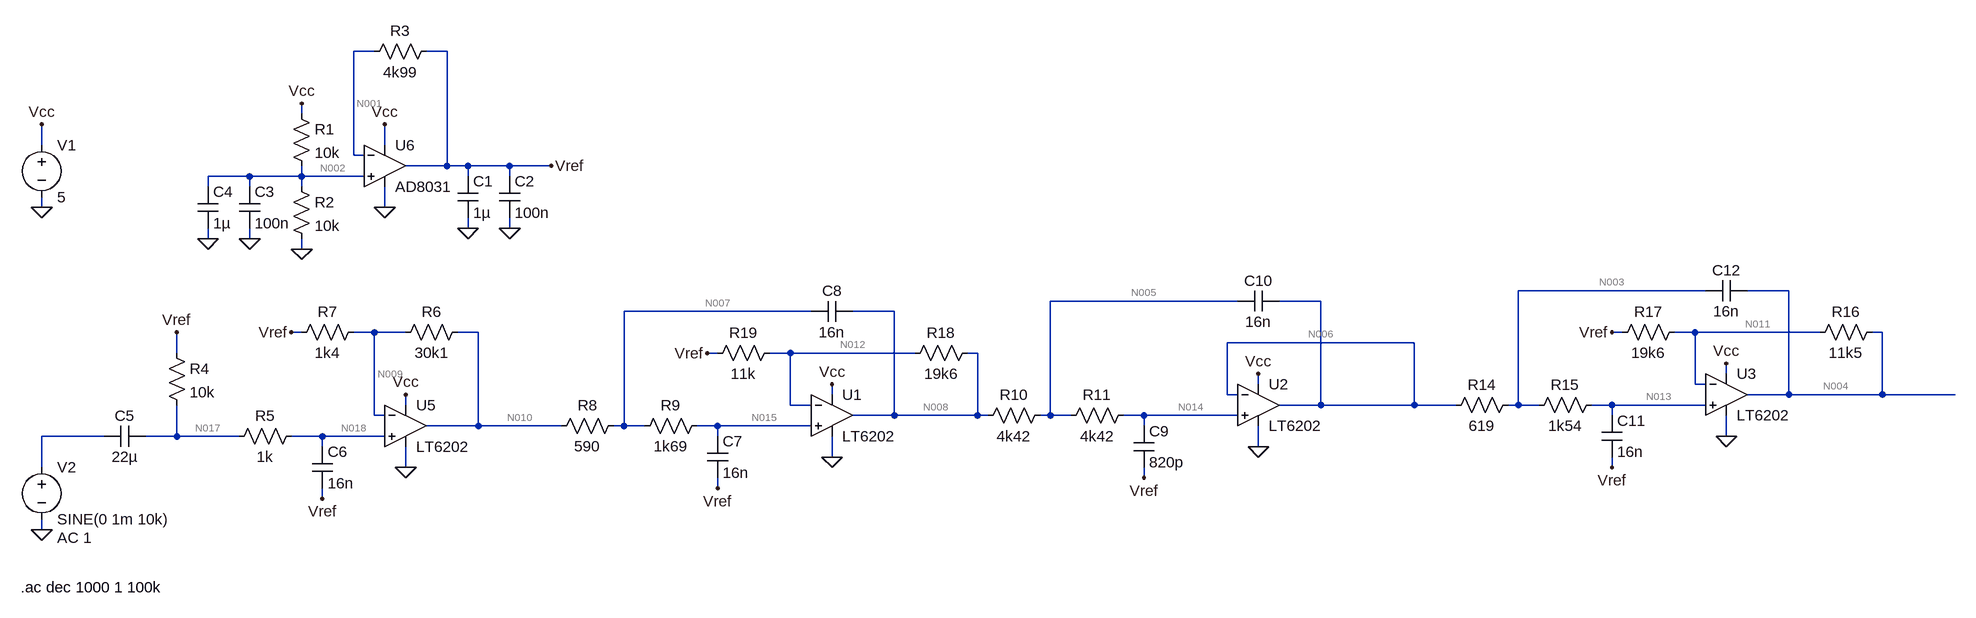
[diagram p0: schematic Input_Stage_10kHz.asc]
Input_Stage_10kHz.asc, the LTspice schematic file:
Version 4
SHEET 1 3012 680
WIRE 272 -400 240 -400
WIRE 384 -400 352 -400
WIRE 160 -304 160 -320
WIRE -240 -256 -240 -288
WIRE 288 -256 288 -288
WIRE 240 -240 240 -400
WIRE 256 -240 240 -240
WIRE 384 -224 384 -400
WIRE 384 -224 320 -224
WIRE 416 -224 384 -224
WIRE 480 -224 416 -224
WIRE 544 -224 480 -224
WIRE 80 -208 16 -208
WIRE 160 -208 160 -224
WIRE 160 -208 80 -208
WIRE 256 -208 160 -208
WIRE 416 -208 416 -224
WIRE 480 -208 480 -224
WIRE 16 -192 16 -208
WIRE 80 -192 80 -208
WIRE 160 -192 160 -208
WIRE -240 -160 -240 -176
WIRE 288 -160 288 -192
WIRE 416 -128 416 -144
WIRE 480 -128 480 -144
WIRE 16 -112 16 -128
WIRE 80 -112 80 -128
WIRE 160 -96 160 -112
WIRE 2320 -32 2032 -32
WIRE 2448 -32 2384 -32
WIRE 1600 -16 1312 -16
WIRE 1728 -16 1664 -16
WIRE 944 0 656 0
WIRE 1072 0 1008 0
WIRE 160 32 144 32
WIRE 272 32 240 32
WIRE 320 32 272 32
WIRE 432 32 400 32
WIRE 2192 32 2176 32
WIRE 2304 32 2272 32
WIRE 2496 32 2304 32
WIRE 2592 32 2576 32
WIRE 1872 48 1584 48
WIRE -32 64 -32 32
WIRE 800 64 784 64
WIRE 912 64 880 64
WIRE 1104 64 912 64
WIRE 1200 64 1184 64
WIRE 2352 96 2352 80
WIRE 1632 112 1632 96
WIRE 2304 112 2304 32
WIRE 2320 112 2304 112
WIRE 976 128 976 112
WIRE 1584 128 1584 48
WIRE 1600 128 1584 128
WIRE 2448 128 2448 -32
WIRE 2448 128 2384 128
WIRE 2592 128 2592 32
WIRE 2592 128 2448 128
WIRE 2704 128 2592 128
WIRE 320 144 320 128
WIRE 912 144 912 64
WIRE 944 144 912 144
WIRE 1728 144 1728 -16
WIRE 1728 144 1664 144
WIRE 1872 144 1872 48
WIRE 1872 144 1728 144
WIRE 1936 144 1872 144
WIRE 2032 144 2032 -32
WIRE 2032 144 2016 144
WIRE 2064 144 2032 144
WIRE 2176 144 2144 144
WIRE 2320 144 2176 144
WIRE 272 160 272 32
WIRE 288 160 272 160
WIRE 1072 160 1072 0
WIRE 1072 160 1008 160
WIRE 1200 160 1200 64
WIRE 1200 160 1072 160
WIRE 1216 160 1200 160
WIRE 1312 160 1312 -16
WIRE 1312 160 1296 160
WIRE 1344 160 1312 160
WIRE 1456 160 1424 160
WIRE 1600 160 1456 160
WIRE 2176 160 2176 144
WIRE 432 176 432 32
WIRE 432 176 352 176
WIRE 560 176 432 176
WIRE 656 176 656 0
WIRE 656 176 640 176
WIRE 688 176 656 176
WIRE 800 176 768 176
WIRE 944 176 800 176
WIRE 1456 176 1456 160
WIRE -144 192 -240 192
WIRE -32 192 -32 144
WIRE -32 192 -80 192
WIRE 64 192 -32 192
WIRE 192 192 144 192
WIRE 288 192 192 192
WIRE 800 192 800 176
WIRE 2352 192 2352 160
WIRE 192 208 192 192
WIRE 1632 208 1632 176
WIRE 976 224 976 192
WIRE -240 240 -240 192
WIRE 320 240 320 208
WIRE 2176 240 2176 224
WIRE 1456 256 1456 240
WIRE 800 272 800 256
WIRE 192 288 192 272
WIRE -240 336 -240 320
FLAG -240 -160 0
FLAG -240 336 0
FLAG -240 -288 Vcc
FLAG 288 -160 0
FLAG 288 -288 Vcc
FLAG 160 -320 Vcc
FLAG 160 -96 0
FLAG 416 -128 0
FLAG 480 -128 0
FLAG 544 -224 Vref
FLAG 16 -112 0
FLAG 80 -112 0
FLAG -32 32 Vref
FLAG 192 288 Vref
FLAG 320 240 0
FLAG 320 128 Vcc
FLAG 800 272 Vref
FLAG 976 224 0
FLAG 976 112 Vcc
FLAG 144 32 Vref
FLAG 1456 256 Vref
FLAG 1632 208 0
FLAG 1632 96 Vcc
FLAG 2176 240 Vref
FLAG 2352 192 0
FLAG 2352 80 Vcc
FLAG 2176 32 Vref
FLAG 784 64 Vref
SYMBOL voltage -240 -272 R0
WINDOW 123 0 0 Left 0
WINDOW 39 0 0 Left 0
SYMATTR InstName V1
SYMATTR Value 5
SYMBOL voltage -240 224 R0
WINDOW 123 24 124 Left 2
WINDOW 39 0 0 Left 0
SYMATTR Value2 AC 1
SYMATTR InstName V2
SYMATTR Value SINE(0 1m 10k)
SYMBOL res 144 -320 R0
SYMATTR InstName R1
SYMATTR Value 10k
SYMBOL res 144 -208 R0
SYMATTR InstName R2
SYMATTR Value 10k
SYMBOL cap 400 -208 R0
SYMATTR InstName C1
SYMATTR Value 1µ
SYMBOL cap 464 -208 R0
SYMATTR InstName C2
SYMATTR Value 100n
SYMBOL cap 64 -192 R0
SYMATTR InstName C3
SYMATTR Value 100n
SYMBOL cap 0 -192 R0
SYMATTR InstName C4
SYMATTR Value 1µ
SYMBOL res 368 -416 R90
WINDOW 0 0 56 VBottom 2
WINDOW 3 32 56 VTop 2
SYMATTR InstName R3
SYMATTR Value 4k99
SYMBOL cap -80 176 R90
WINDOW 0 0 32 VBottom 2
WINDOW 3 32 32 VTop 2
SYMATTR InstName C5
SYMATTR Value 22µ
SYMBOL res -48 48 R0
SYMATTR InstName R4
SYMATTR Value 10k
SYMBOL res 160 176 R90
WINDOW 0 0 56 VBottom 2
WINDOW 3 32 56 VTop 2
SYMATTR InstName R5
SYMATTR Value 1k
SYMBOL cap 176 208 R0
SYMATTR InstName C6
SYMATTR Value 16n
SYMBOL res 416 16 R90
WINDOW 0 0 56 VBottom 2
WINDOW 3 32 56 VTop 2
SYMATTR InstName R6
SYMATTR Value 30k1
SYMBOL res 256 16 R90
WINDOW 0 0 56 VBottom 2
WINDOW 3 32 56 VTop 2
SYMATTR InstName R7
SYMATTR Value 1k4
SYMBOL res 656 160 R90
WINDOW 0 0 56 VBottom 2
WINDOW 3 32 56 VTop 2
SYMATTR InstName R8
SYMATTR Value 590
SYMBOL res 784 160 R90
WINDOW 0 0 56 VBottom 2
WINDOW 3 32 56 VTop 2
SYMATTR InstName R9
SYMATTR Value 1k69
SYMBOL cap 784 192 R0
SYMATTR InstName C7
SYMATTR Value 16n
SYMBOL cap 1008 -16 R90
WINDOW 0 0 32 VBottom 2
WINDOW 3 32 32 VTop 2
SYMATTR InstName C8
SYMATTR Value 16n
SYMBOL res 1312 144 R90
WINDOW 0 0 56 VBottom 2
WINDOW 3 32 56 VTop 2
SYMATTR InstName R10
SYMATTR Value 4k42
SYMBOL res 1440 144 R90
WINDOW 0 0 56 VBottom 2
WINDOW 3 32 56 VTop 2
SYMATTR InstName R11
SYMATTR Value 4k42
SYMBOL cap 1440 176 R0
SYMATTR InstName C9
SYMATTR Value 820p
SYMBOL cap 1664 -32 R90
WINDOW 0 0 32 VBottom 2
WINDOW 3 32 32 VTop 2
SYMATTR InstName C10
SYMATTR Value 16n
SYMBOL res 2032 128 R90
WINDOW 0 0 56 VBottom 2
WINDOW 3 32 56 VTop 2
SYMATTR InstName R14
SYMATTR Value 619
SYMBOL res 2160 128 R90
WINDOW 0 0 56 VBottom 2
WINDOW 3 32 56 VTop 2
SYMATTR InstName R15
SYMATTR Value 1k54
SYMBOL cap 2160 160 R0
SYMATTR InstName C11
SYMATTR Value 16n
SYMBOL cap 2384 -48 R90
WINDOW 0 0 32 VBottom 2
WINDOW 3 32 32 VTop 2
SYMATTR InstName C12
SYMATTR Value 16n
SYMBOL res 2592 16 R90
WINDOW 0 0 56 VBottom 2
WINDOW 3 32 56 VTop 2
SYMATTR InstName R16
SYMATTR Value 11k5
SYMBOL res 2288 16 R90
WINDOW 0 0 56 VBottom 2
WINDOW 3 32 56 VTop 2
SYMATTR InstName R17
SYMATTR Value 19k6
SYMBOL OpAmps\\AD8031 288 -288 R0
SYMATTR InstName U6
SYMBOL res 1200 48 R90
WINDOW 0 0 56 VBottom 2
WINDOW 3 32 56 VTop 2
SYMATTR InstName R18
SYMATTR Value 19k6
SYMBOL res 896 48 R90
WINDOW 0 0 56 VBottom 2
WINDOW 3 32 56 VTop 2
SYMATTR InstName R19
SYMATTR Value 11k
SYMBOL OpAmps\\LT6202 320 176 R0
SYMATTR InstName U5
SYMBOL OpAmps\\LT6202 976 160 R0
SYMATTR InstName U1
SYMBOL OpAmps\\LT6202 1632 144 R0
SYMATTR InstName U2
SYMBOL OpAmps\\LT6202 2352 128 R0
SYMATTR InstName U3
TEXT -272 424 Left 2 !.ac dec 1000 1 100k

The netlist it stands for:
* Input_Stage_10kHz.asc
V1 Vcc 0 5
V2 N016 0 SINE(0 1m 10k) AC 1
R1 Vcc N002 10k
R2 N002 0 10k
C1 Vref 0 1µ
C2 Vref 0 100n
C3 N002 0 100n
C4 N002 0 1µ
R3 Vref N001 4k99
C5 N017 N016 22µ
R4 Vref N017 10k
R5 N018 N017 1k
C6 N018 Vref 16n
R6 N010 N009 30k1
R7 N009 Vref 1k4
R8 N007 N010 590
R9 N015 N007 1k69
C7 N015 Vref 16n
C8 N008 N007 16n
R10 N005 N008 4k42
R11 N014 N005 4k42
C9 N014 Vref 820p
C10 N006 N005 16n
R14 N003 N006 619
R15 N013 N003 1k54
C11 N013 Vref 16n
C12 N004 N003 16n
R16 N004 N011 11k5
R17 N011 Vref 19k6
XU6 N002 N001 Vcc 0 Vref AD8031  ; pins In+ In- V+ V- OUT
R18 N008 N012 19k6
R19 N012 Vref 11k
* U5: LT6202 (symbol OpAmps\LT6202 not available, pins judged from their places): In+=N018 In-=N009 V+=Vcc V-=0 OUT=N010
* U1: LT6202 (symbol OpAmps\LT6202 not available, pins judged from their places): In+=N015 In-=N012 V+=Vcc V-=0 OUT=N008
* U2: LT6202 (symbol OpAmps\LT6202 not available, pins judged from their places): In+=N014 In-=N006 V+=Vcc V-=0 OUT=N006
* U3: LT6202 (symbol OpAmps\LT6202 not available, pins judged from their places): In+=N013 In-=N011 V+=Vcc V-=0 OUT=N004
.ac dec 1000 1 100k
.backanno
.end

* Results of the author's LTspice run, read from the files saved beside the schematic
* Operating Point, zero values left out:
*   V(vcc) = 5 V
*   V(n002) = 2.502 V
*   V(vref) = 2.5 V
*   V(n001) = 2.502 V
*   V(n017) = 2.515 V
*   V(n018) = 2.517 V
*   V(n010) = 2.828 V
*   V(n009) = 2.517 V
*   V(n007) = 2.829 V
*   V(n015) = 2.831 V
*   V(n008) = 3.393 V
*   V(n005) = 3.398 V
*   V(n014) = 3.404 V
*   V(n006) = 3.403 V
*   V(n003) = 3.404 V
*   V(n013) = 3.406 V
*   V(n004) = 3.923 V
*   V(n011) = 3.406 V
*   V(n012) = 2.831 V
*   I(R1) = 249.8 µA
*   I(R2) = 250.2 µA
*   I(R3) = -450 nA
*   I(R4) = -1.522 µA
*   I(R5) = 1.522 µA
*   I(R6) = 10.34 µA
*   I(R7) = 11.88 µA
*   I(R8) = 1.412 µA
*   I(R9) = 1.412 µA
*   I(R10) = 1.211 µA
*   I(R11) = 1.211 µA
*   I(R14) = 1.21 µA
*   I(R15) = 1.21 µA
*   I(R16) = 44.99 µA
*   I(R17) = 46.22 µA
*   I(R18) = 28.66 µA
*   I(R19) = 30.09 µA
*   I(V1) = -11.34 mA